# EAGLE design Circuit (EAGLE 6.3)
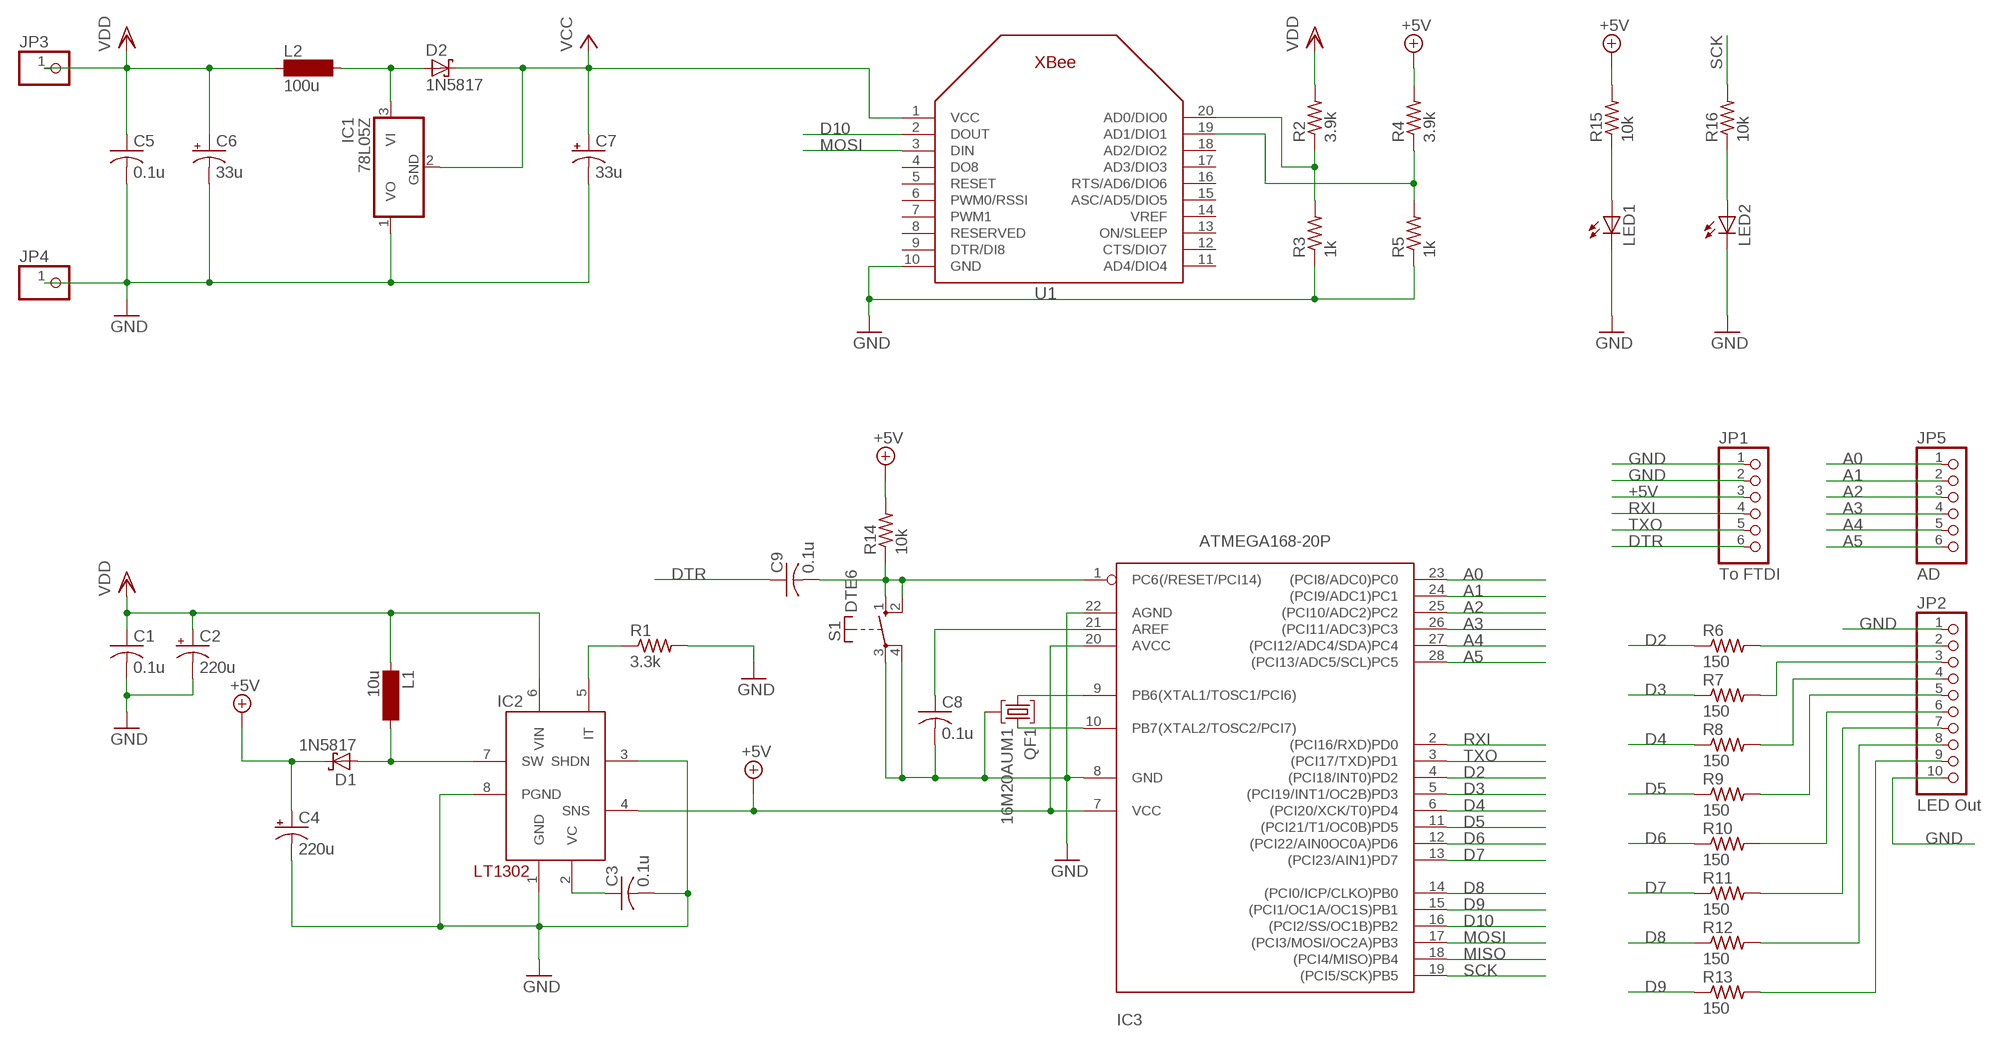
[diagram p0: schematic, sheet 1]

## Parts
C1  0.1u  C-US050-025X075  [C050-025X075]
C2  220u  CPOL-USE2.5-6  [E2,5-6]
C3  0.1u  C-US050-025X075  [C050-025X075]
C4  220u  CPOL-USE2.5-6  [E2,5-6]
C5  0.1u  C-US050-025X075  [C050-025X075]
C6  33u  CPOL-USE2.5-5  [E2,5-5]
C7  33u  CPOL-USE2.5-5  [E2,5-5]
C8  0.1u  C-US050-025X075  [C050-025X075]
C9  0.1u  C-US050-025X075  [C050-025X075]
D1  1N5817  SCHOTTKY-DIODEDO35-7  [DO35-7]
D2  1N5817  BAT49  [DO41-10]
IC1  78L05Z  [TO92]
IC2  LT1302  [DIL08]
IC3  ATMEGA168-20P  [DIL28-3]
JP1  To FTDI  PINHD-1X6  [1X06]
JP2  LED Out  PINHD-1X10  [1X10-BIG]
JP3  PINHD-1X1  [1X01]
JP4  PINHD-1X1  [1X01]
JP5  AD  PINHD-1X6  [1X06]
L1  10u  BS11  [BS11]
L2  100u  BS11  [BS11]
LED1  LED3MM  [LED3MM]
LED2  LED3MM  [LED3MM]
QF1  16M20AUM1  [UM1]
R1  3.3k  R-US_0204/7  [0204/7]
R2  3.9k  R-US_0207/7  [0207/7]
R3  1k  R-US_0207/7  [0207/7]
R4  3.9k  R-US_0207/7  [0207/7]
R5  1k  R-US_0207/7  [0207/7]
R6  150  R-US_0204/7  [0204/7]
R7  150  R-US_0204/7  [0204/7]
R8  150  R-US_0204/7  [0204/7]
R9  150  R-US_0204/7  [0204/7]
R10  150  R-US_0204/7  [0204/7]
R11  150  R-US_0204/7  [0204/7]
R12  150  R-US_0204/7  [0204/7]
R13  150  R-US_0204/7  [0204/7]
R14  10k  R-US_0204/7  [0204/7]
R15  10k  R-US_0207/7  [0207/7]
R16  10k  R-US_0207/7  [0207/7]
S1  DTE6  [DTE6]
U1  XBEE  [XBEE]

## Nets
+5V: C4.+ D1.C IC2.4(SNS) IC3.7(VCC) IC3.20(AVCC) JP1.3 R4.2 R14.2 R15.2
A0: IC3.23((PCI8/ADC0)PC0) JP5.1
A1: IC3.24((PCI9/ADC1)PC1) JP5.2
A2: IC3.25((PCI10/ADC2)PC2) JP5.3
A3: IC3.26((PCI11/ADC3)PC3) JP5.4
A4: IC3.27((PCI12/ADC4/SDA)PC4) JP5.5
A5: IC3.28((PCI13/ADC5/SCL)PC5) JP5.6
D2: IC3.4((PCI18/INT0)PD2) R6.1
D3: IC3.5((PCI19/INT1/OC2B)PD3) R7.1
D4: IC3.6((PCI20/XCK/T0)PD4) R8.1
D5: IC3.11((PCI21/T1/OC0B)PD5) R9.1
D6: IC3.12((PCI22/AIN0OC0A)PD6) R10.1
D7: IC3.13((PCI23/AIN1)PD7) R11.1
D8: IC3.14((PCI0/ICP/CLKO)PB0) R12.1
D9: IC3.15((PCI1/OC1A/OC1S)PB1) R13.1
D10: IC3.16((PCI2/SS/OC1B)PB2) U1.2(DOUT)
DTR: C9.1 JP1.6
GND: C1.2 C2.- C3.2 C4.- C5.2 C6.- C7.- C8.2 IC1.1(VO) IC2.1(GND) IC2.3(SHDN) IC2.8(PGND) IC3.8(GND) IC3.22(AGND) JP1.1 JP1.2 JP2.1 JP2.10 JP4.1 LED1.K(C) LED2.K(C) QF1.2 R1.2 R3.1 R5.1 S1.3(P) S1.4(P) U1.10(GND)
MISO: IC3.18((PCI4/MISO)PB4)
MOSI: IC3.17((PCI3/MOSI/OC2A)PB3) U1.3(DIN)
N$1: C3.1 IC2.2(VC)
N$2: D1.A IC2.7(SW) L1.2
N$3: R4.1 R5.2 U1.19(AD1/DIO1)
N$4: IC2.5(IT) R1.1
N$5: D2.A IC1.3(VI) L2.2
N$6: C8.1 IC3.21(AREF)
N$7: IC3.9(PB6(XTAL1/TOSC1/PCI6)) QF1.1
N$8: IC3.10(PB7(XTAL2/TOSC2/PCI7)) QF1.3
N$9: R2.1 R3.2 U1.20(AD0/DIO0)
N$10: JP2.2 R6.2
N$11: JP2.3 R7.2
N$12: JP2.4 R8.2
N$13: JP2.5 R9.2
N$14: JP2.6 R10.2
N$15: JP2.7 R11.2
N$16: JP2.8 R12.2
N$17: C9.2 IC3.1(PC6(/RESET/PCI14)) R14.1 S1.1(S) S1.2(S)
N$18: LED1.A R15.1
N$19: LED2.A R16.1
N$22: JP2.9 R13.2
RXI: IC3.2((PCI16/RXD)PD0) JP1.4
SCK: IC3.19((PCI5/SCK)PB5) R16.2
TXO: IC3.3((PCI17/TXD)PD1) JP1.5
VCC: C7.+ D2.C IC1.2(GND) U1.1(VCC)
VDD: C1.1 C2.+ C5.1 C6.+ IC2.6(VIN) JP3.1 L1.1 L2.1 R2.2
Unconnected: U1.4(DO8) U1.5(RESET) U1.6(PWM0/RSSI) U1.7(PWM1) U1.8(RESERVED) U1.9(DTR/DI8) U1.11(AD4/DIO4) U1.12(CTS/DIO7) U1.13(ON/SLEEP) U1.14(VREF) U1.15(ASC/AD5/DIO5) U1.16(RTS/AD6/DIO6) U1.17(AD3/DIO3) U1.18(AD2/DIO2)

## Library data of the parts
C1 C3 C5 C8 C9 = rcl:C-US: CAPACITOR, American symbol
C2 C4 C6 C7 = adafruit:CPOL-US: POLARIZED CAPACITOR, American symbol
D1 = adafruit:SCHOTTKY-DIODE: Schottky Diode
D2 = diode:BAT49: DIODE small signal diode
IC1 = adafruit:78*: Positive VOLTAGE REGULATOR Added bigger pads to the TO-92 package
IC2 = adafruit:LT1302
IC3 = adafruit:ATMEGA168*P: MICROCONTROLLER 16 kBytes FLASH 1 kBytes SRAM 512 Bytes EEPROM USART 8-channel 10 bit ADC
JP1 JP5 = adafruit:PINHD-1X6: PIN HEADER
JP2 = adafruit:PINHD-1X10: Pin header 1x10 0.1" spacing With round pins
JP3 JP4 = adafruit:PINHD-1X1: Pin header 1x1 for 0.1" spacing With round pins
L1 L2 = inductor-neosid:BS: INDUCTOR nominal inductance, magnetically screened; OC_FARNELL: unknown; OC_NEWARK: unknown
LED1 LED2 = adafruit:LED: LED OSRAM: - CHIPLED LG R971, LG N971, LY N971, LG Q971, LY Q971, LO R971, LY R971 LH N974, LH R974 LS Q976, LO Q976, LY Q976 LO Q996 - Hyper CHIPLED LW Q18S LB Q993, LB Q99A, LB R99A - SideLED LS A670, LO A670, LY A670, LG A670, LP A670 LB A673, LV A673, LT A673, LW A673 LH A674 LY A675 LS A676, LA A676, LO A676, LY A676, LW A676 LS A679, LY A679, LG A679 - Hyper Micro SIDELED® LS Y876, LA Y876, LO Y876, LY Y876 LT Y87S - SmartLED LW L88C, LW L88S LB L89C, LB L89S, LG L890 LS L89K, LO L89K, LY L89K LS L896, LA L896, LO L896, LY L896 - TOPLED LS T670, LO T670, LY T670, LG T670, LP T670 LSG T670, LSP T670, LSY T670, LOP T670, LYG T670 LG T671, LOG T671, LSG T671 LB T673, LV T673, LT T673, LW T673 LH T674 LS T676, LA T676, LO T676, LY T676, LB T676, LH T676, LSB T676, LW T676 LB T67C, LV T67C, LT T67C, LS T67K, LO T67K, LY T67K, LW E67C LS E67B, LA E67B, LO E67B, LY E67B, LB E67C, LV E67C, LT E67C LW T67C LS T679, LY T679, LG T679 LS T770, LO T770, LY T770, LG T770, LP T770 LB T773, LV T773, LT T773, LW T773 LH T774 LS E675, LA E675, LY E675, LS T675 LS T776, LA T776, LO T776, LY T776, LB T776 LHGB T686 LT T68C, LB T68C - Hyper Mini TOPLED® LB M676 - Mini TOPLED Santana® LG M470 LS M47K, LO M47K, LY M47K Source: http://www.osram.convergy.de/
QF1 = crystal:16M20AUM1: Monolithic Crystal Filters Source: www.vanlong.com; OC_FARNELL: unknown; OC_NEWARK: unknown
R1 R6-R14 = rcl:R-US_: RESISTOR, American symbol
R2-R5 R15 R16 = resistor:R-US_: RESISTOR, American symbol
S1 = switch-misc:DT: ITT SWITCH
U1 = adafruit:XBEE

## Board
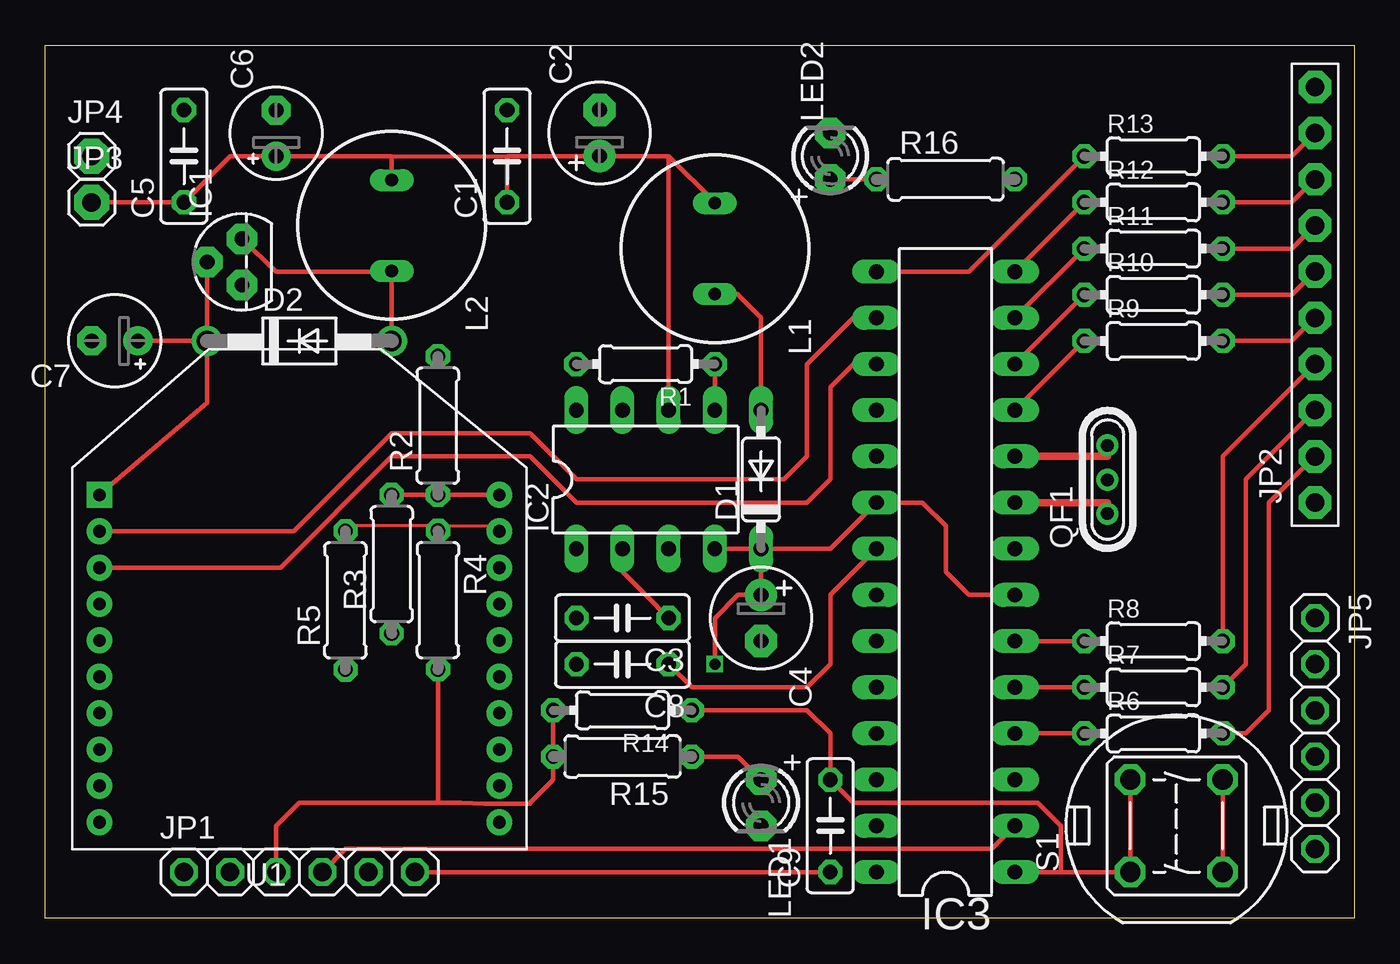
[diagram p1: board, top side]
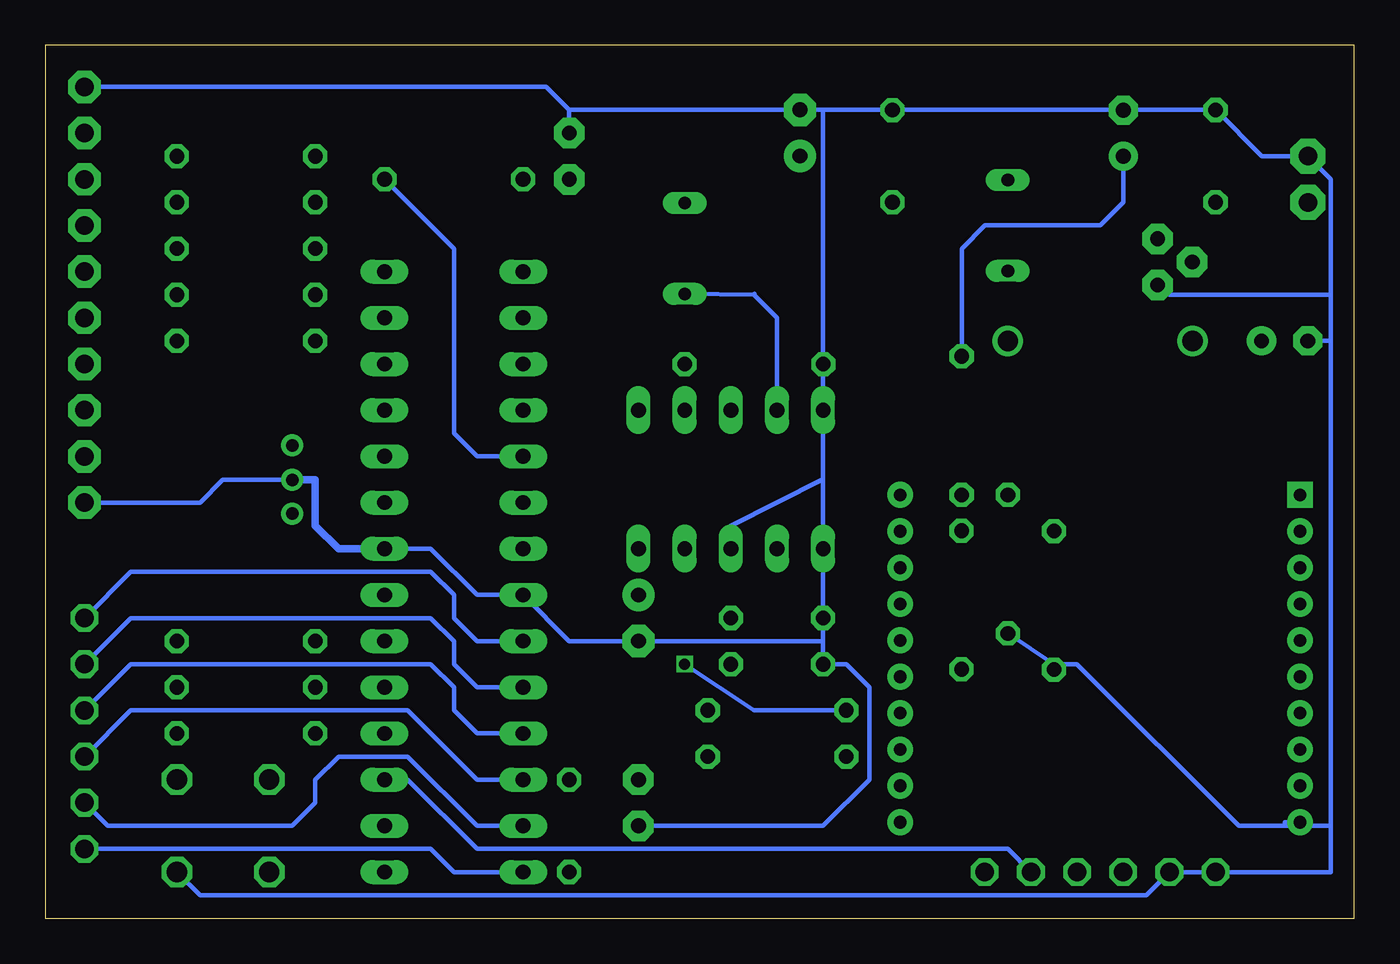
[diagram p2: board, bottom side, seen from below]

Size 72 x 48 mm. Coordinates in mm from the lower left corner, seen from the top.
Outline: 0,0 0,48 72,48 72,0 0,0
Copper layers (1*16): Top 0.035mm / dielectric 1.5mm / Bottom 0.035mm
Design rules "Fusion_eagle_rule_v1.1": minimum track width 6mil, minimum drill 12mil, track to track 6mil, track to pad 6mil, pad to pad 6mil, via to via 6mil, smd to smd 0mil, copper to edge 10mil, drill to drill 10mil, minimum pad ring 10mil, minimum via ring 6mil, stop-mask expansion 2mil, vias tented up to drill 100mil, thermal gap 10mil

### Footprints (pad centres in the part's own frame; a part is rotated, then mirrored left to right if it is on the bottom)
C050-025X075 = drill 0.813 octagon: 1 -2.54,0; 2 2.54,0
E2,5-6 = drill 0.813 pad 1.778: + -1.27,0 | drill 0.813 pad 1.778 octagon: - 1.27,0
E2,5-5 = drill 0.813 pad 1.6: + -1.27,0 | drill 0.813 pad 1.6 octagon: - 1.27,0
DO35-7 = drill 0.813 long: A 3.81,0; C -3.81,0
DO41-10 = drill 1.118: A 5.08,0; C -5.08,0
TO92 = drill 0.813 pad 1.676 octagon: 1 -1.27,0; 2 0,1.905; 3 1.27,0
DIL08 = drill 0.813 long: 1 -3.81,-3.81; 2 -1.27,-3.81; 3 1.27,-3.81; 4 3.81,-3.81; 5 3.81,3.81; 6 1.27,3.81; 7 -1.27,3.81; 8 -3.81,3.81
DIL28-3 = drill 0.813 long: 1 -16.51,-3.81; 2 -13.97,-3.81; 3 -11.43,-3.81; 4 -8.89,-3.81; 5 -6.35,-3.81; 6 -3.81,-3.81; 7 -1.27,-3.81; 8 1.27,-3.81; 9 3.81,-3.81; 10 6.35,-3.81; 11 8.89,-3.81; 12 11.43,-3.81; 13 13.97,-3.81; 14 16.51,-3.81; 15 16.51,3.81; 16 13.97,3.81; 17 11.43,3.81; 18 8.89,3.81; 19 6.35,3.81; 20 3.81,3.81; 21 1.27,3.81; 22 -1.27,3.81; 23 -3.81,3.81; 24 -6.35,3.81; 25 -8.89,3.81; 26 -11.43,3.81; 27 -13.97,3.81; 28 -16.51,3.81
1X06 = drill 1.016 octagon: 1 -6.35,0; 2 -3.81,0; 3 -1.27,0; 4 1.27,0; 5 3.81,0; 6 6.35,0
1X10-BIG = drill 1.016 pad 1.778 octagon: 1 -11.43,0; 2 -8.89,0; 3 -6.35,0; 4 -3.81,0; 5 -1.27,0; 6 1.27,0; 7 3.81,0; 8 6.35,0; 9 8.89,0; 10 11.43,0
1X01 = drill 1.016 pad 1.93 octagon: 1 0,0
BS11 = drill 0.7 long: 1 -2.5,0; 2 2.5,0
LED3MM = drill 0.813 pad 1.676 octagon: A -1.27,0; K 1.27,0
UM1 = drill 0.7 pad 1.2: 1 -1.875,0; 2 -0.027,0; 3 1.875,0
0204/7 = drill 0.813 octagon: 1 -3.81,0; 2 3.81,0
0207/7 = drill 0.813 octagon: 1 -3.81,0; 2 3.81,0
DTE6 = drill 1.118 octagon: 1 -2.54,2.54; 2 2.54,2.54; 3 2.54,-2.54; 4 -2.54,-2.54
XBEE = drill 0.7 pad 1.422 square: 1 -11,5.5 | drill 0.7 pad 1.422: 2 -11,3.5; 3 -11,1.5; 4 -11,-0.5; 5 -11,-2.5; 6 -11,-4.5; 7 -11,-6.5; 8 -11,-8.5; 9 -11,-10.5; 10 -11,-12.5; 11 11,-12.5; 12 11,-10.5; 13 11,-8.5; 14 11,-6.5; 15 11,-4.5; 16 11,-2.5; 17 11,-0.5; 18 11,1.5; 19 11,3.5; 20 11,5.5

### Placement (x,y rotation side)
C1  25.4,41.91 90 top
C2  30.49,43.19 90 top
C3  31.75,16.51 180 top
C4  39.37,16.51 270 top
C5  7.62,41.91 90 top
C6  12.7,43.17 90 top
C7  3.82,31.75 180 top
C8  31.75,13.97 180 top
C9  43.18,5.08 90 top
D1  39.37,24.13 90 top
D2  13.97,31.75 0 top
IC1  10.81,36.09 90 top
IC2  33.02,24.13 0 top
IC3  49.53,19.05 90 top
JP1  13.97,2.54 0 top
JP2  69.85,34.29 90 top
JP3  2.54,39.37 0 top
JP4  2.54,41.91 0 top
JP5  69.85,10.16 270 top
L1  36.83,36.83 270 top
L2  19.05,38.1 270 top
LED1  39.37,6.35 270 top
LED2  43.18,41.91 90 top
QF1  58.42,24.13 90 top
R1  33.02,30.48 180 top
R2  21.59,27.09 90 top
R3  19.05,19.47 90 top
R4  21.59,17.5 270 top
R5  16.51,17.48 90 top
R6  60.96,10.16 0 top
R7  60.96,12.7 0 top
R8  60.96,15.24 0 top
R9  60.96,31.75 0 top
R10  60.96,34.29 0 top
R11  60.96,36.83 0 top
R12  60.96,39.37 0 top
R13  60.96,41.91 0 top
R14  31.75,11.43 180 top
R15  31.75,8.89 180 top
R16  49.53,40.64 0 top
S1  62.23,5.08 90 top
U1  13.97,17.78 0 top

### Tracks (layer width: path | path; a pad name or v marks a point on that pad's centre or on a via)
+5V  (via drill 0.6)
  Top 0.254: D1.C 40.64,20.32 D1.C | D1.C C4.+ 38.1,17.78 36.83,16.51 v36.83,13.97 | D1.C | D1.C 40.64,20.32 IC2.4 | D1.C 40.64,20.32 43.18,20.32 IC3.20 48.26,22.86 49.53,21.59 49.53,19.05 50.8,17.78 IC3.7 | R14.2 R15.2 27.94,7.62 26.66,6.34 26.66,6.28 24.12,6.28 22.86,6.35 21.59,6.35 | JP1.3 12.7,5.08 13.97,6.35 21.59,6.35 | R4.2 21.59,6.35
  Bottom 0.254: R14.2 33.02,11.43 v36.83,13.97
A0
  Bottom 0.254: IC3.23 48.26,15.24 49.53,16.51 49.53,17.78 50.8,19.05 67.31,19.05 JP5.1
A1
  Bottom 0.254: IC3.24 48.26,12.7 49.53,13.97 49.53,15.24 50.8,16.51 67.31,16.51 JP5.2
A2
  Bottom 0.254: IC3.25 48.26,10.16 49.53,11.43 49.53,12.7 50.8,13.97 67.31,13.97 JP5.3
A3
  Bottom 0.254: IC3.26 48.26,7.62 52.07,11.43 67.31,11.43 JP5.4
A4
  Bottom 0.254: IC3.27 48.26,5.08 52.07,8.89 55.88,8.89 57.15,7.62 57.15,6.35 58.42,5.08 68.58,5.08 JP5.5
A5
  Bottom 0.254: IC3.28 49.53,2.54 50.8,3.81 JP5.6
D2
  Top 0.254: IC3.4 R6.1
D3
  Top 0.254: R7.1 IC3.5
D4
  Top 0.254: IC3.6 R8.1
D5
  Top 0.254: R9.1 IC3.11
D6
  Top 0.254: R10.1 IC3.12
D7
  Top 0.254: R11.1 IC3.13
D8
  Top 0.254: R12.1 IC3.14
D9
  Top 0.254: IC3.15 50.8,35.56 R13.1
D10
  Top 0.254: U1.2 13.66,21.28 19.05,26.67 26.67,26.67 29.21,24.13 40.64,24.13 41.91,25.4 41.91,30.48 44.45,33.02 IC3.16
DTR
  Top 0.254: C9.1 JP1.6
GND
  Top 0.254: S1.3 S1.4
  Bottom 0.254: R3.1 16.51,13.97 | 1.27,5.08 3.81,5.08 | 16.51,13.97 15.24,13.97 6.35,5.08 3.81,5.08 | 3.81,5.08 3.81,5.28 U1.10 | 16.51,13.97 16.52,13.97 R5.1 | IC2.8 29.21,24.13 | 29.21,24.13 IC2.1 | IC2.8 | 29.21,29.21 R1.2 | 29.21,29.21 IC2.8 | IC2.1 29.21,15.24 | 29.21,15.24 C3.2 | IC2.1 | 29.21,24.13 34.29,21.59 IC2.3 | 29.21,24.13 IC2.8 | 1.27,34.29 10.16,34.29 IC1.1 | 27.94,44.45 29.21,44.45 | 33.02,44.45 29.21,44.45 | 29.21,29.21 IC2.8 | 29.21,15.24 40.64,15.24 | 40.64,15.24 C4.- 40.64,15.24 | 33.02,44.45 C1.2 33.02,44.45 | 27.94,44.45 C6.- | C6.- C5.2 5.08,41.91 JP4.1 1.27,40.64 1.27,34.29 | 27.94,44.45 C2.- | 1.27,31.75 C7.- | 29.21,44.45 R1.2 | R1.2 | 1.27,31.75 1.27,5.08 | 1.27,34.29 1.27,31.75 | C6.- | 40.64,15.24 43.18,15.24 IC3.22 48.26,17.78 50.8,20.32 IC3.8 | 40.64,15.24 | 29.21,15.24 C8.2 27.94,13.97 26.67,12.7 26.67,7.62 29.21,5.08 LED1.K | 1.27,5.08 1.27,2.54 JP1.1 JP1.2 11.43,1.27 63.5,1.27 S1.4 | 43.18,44.45 33.02,44.45 | LED2.K 43.18,44.45 | QF1.2 62.26,24.1 63.5,22.86 JP2.1 | JP2.10 44.45,45.72 43.18,44.45
  Bottom 0.406: QF1.2 57.15,24.1 57.15,21.59 55.88,20.32 IC3.8
MOSI
  Top 0.254: U1.3 12.93,19.28 19.05,25.4 26.67,25.4 29.21,22.86 41.91,22.86 43.18,24.13 43.18,29.21 44.45,30.48 IC3.17
N$1
  Top 0.254: IC2.2 31.75,19.05 33.02,17.78 C3.1
N$2
  Top 0.254: D1.A 39.37,33.02 38.06,34.33 L1.2
  Bottom 0.254: 32.98,34.33 33.02,34.29 | 33.02,34.29 L1.2 | IC2.7 31.75,33.02 33.02,34.29
N$3
  Top 0.152: 21.59,21.59 16.51,21.59 R5.2 | 21.59,21.59 25.4,21.59 U1.19 | 21.59,21.59 R4.1
N$4
  Top 0.254: R1.1 36.83,29.21 IC2.5
N$5
  Top 0.254: D2.A 19.05,35.56 | 19.05,35.56 12.7,35.56 IC1.3 | 19.05,35.56 L2.2
N$6
  Top 0.254: C8.1 35.56,12.7 41.91,12.7 43.18,13.97 43.18,17.78 IC3.21
N$7
  Top 0.406: QF1.1 58.42,22.86 IC3.9
N$8
  Top 0.406: IC3.10 58.42,25.4 QF1.3
N$9
  Top 0.254: 22.87,23.28 R3.2 | 22.87,23.28 24.15,23.28 U1.20 | 22.87,23.28 R2.1
N$10
  Top 0.254: R6.2 66.04,10.16 67.31,11.43 67.31,22.86 JP2.2
N$11
  Top 0.254: R7.2 66.04,13.97 66.04,24.13 JP2.3
N$12
  Top 0.254: JP2.4 64.77,25.4 R8.2
N$13
  Top 0.254: R9.2 68.58,31.75 JP2.5
N$14
  Top 0.254: R10.2 68.58,34.29 JP2.6
N$15
  Top 0.254: R11.2 68.58,36.83 JP2.7
N$16
  Top 0.254: R12.2 68.58,39.37 JP2.8
N$17
  Top 0.254: R14.1 41.91,11.43 43.18,10.16 C9.2 44.45,6.35 54.61,6.35 55.88,5.08 55.88,2.54 IC3.1 S1.1 S1.2
N$18
  Top 0.254: R15.1 38.1,8.89 LED1.A
N$19
  Top 0.254: LED2.A R16.1
N$22
  Top 0.254: R13.2 68.58,41.91 JP2.9
RXI
  Top 0.254: JP1.4 16.51,3.81 52.07,3.81 IC3.2
SCK
  Bottom 0.254: R16.2 49.53,36.83 49.53,26.67 48.26,25.4 IC3.19
TXO
  Bottom 0.254: JP1.5 19.05,3.81 48.26,3.81 52.07,7.62 IC3.3
VCC
  Top 0.254: D2.C C7.+ | D2.C 8.89,34.29 IC1.2 | U1.1 8.89,28.36 D2.C
VDD
  Top 0.254: C6.+ 19.05,41.91 | C6.+ 10.16,41.91 C5.1 JP3.1 | C6.+ | IC2.6 34.29,29.21 34.29,41.91 | C1.1 25.44,41.87 19.05,41.91 | 19.05,41.91 L2.1 | C1.1 | C1.1 25.4,41.91 26.68,41.92 C2.+ 34.28,41.92 34.29,41.91 | 34.29,41.91 36.83,39.37 L1.1
  Bottom 0.254: R2.2 21.59,36.83 20.32,38.1 13.97,38.1 12.7,39.37 C6.+